# EAGLE schematic Line_Sensor v1 (EAGLE 9.7.0)
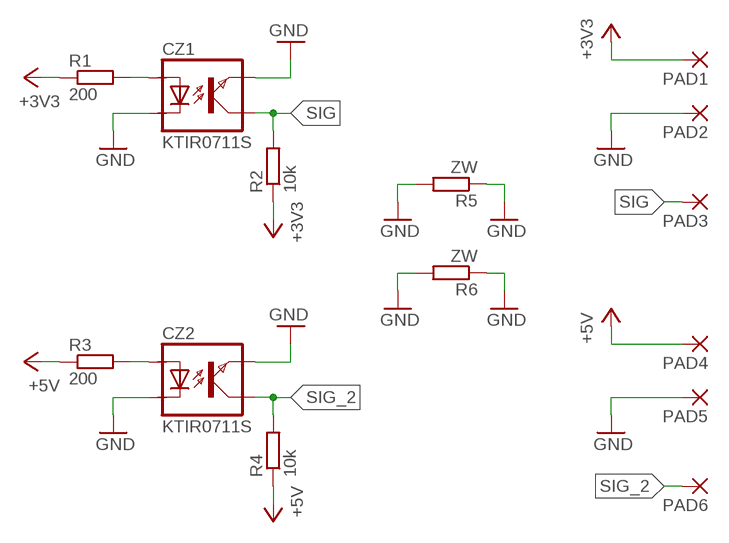
[diagram p0: schematic, sheet 1]

## Parts
CZ1  KTIR0711S  [TOP]
CZ2  KTIR0711S  [TOP]
PAD1  SMD5  [SMD2,54-5,08]
PAD2  SMD5  [SMD2,54-5,08]
PAD3  SMD5  [SMD2,54-5,08]
PAD4  SMD5  [SMD2,54-5,08]
PAD5  SMD5  [SMD2,54-5,08]
PAD6  SMD5  [SMD2,54-5,08]
R1  200  R-EU_R1206  [R1206]
R2  10k  R-EU_R1206  [R1206]
R3  200  R-EU_R1206  [R1206]
R4  10k  R-EU_R1206  [R1206]
R5  ZW  R-EU_R1206  [R1206]
R6  ZW  R-EU_R1206  [R1206]

## Nets
+3V3: PAD1.1(P) R1.1 R2.1
+5V: PAD4.1(P) R3.1 R4.1
GND: CZ1.EMITER CZ1.KATODA CZ2.EMITER CZ2.KATODA PAD2.1(P) PAD5.1(P) R5.1 R5.2 R6.1 R6.2
N$1: CZ1.ANODA R1.2
N$2: CZ2.ANODA R3.2
SIG: CZ1.KOLEKTOR PAD3.1(P) R2.2
SIG_2: CZ2.KOLEKTOR PAD6.1(P) R4.2

## Library data of the parts
CZ1 CZ2 = KTIR0711S:KTIR0711S
PAD1-PAD6 = wirepad:SMD5: SMD PAD
R1-R6 = rcl:R-EU_: RESISTOR, European symbol